# Altium schematic sheet USB2514 POWER DISTRIBUTION SWITCHES.SchDoc
size A4; DocumentNumber: 4; SheetNumber: 4; SheetTotal: 6
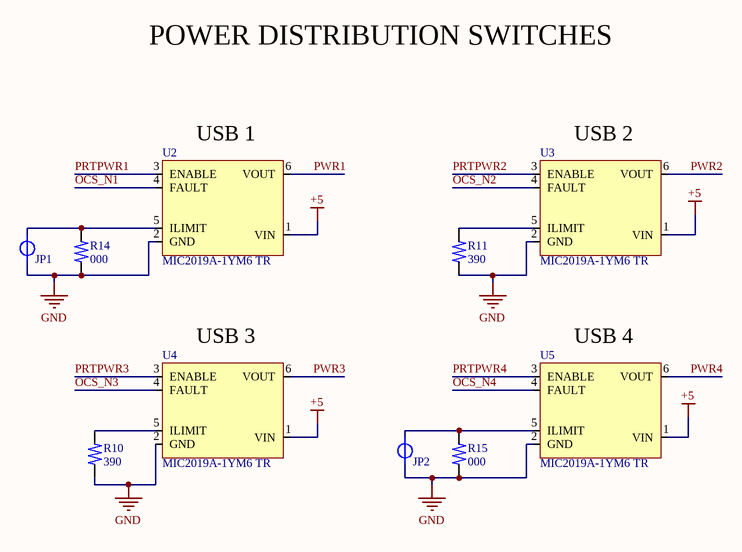
[diagram p0: USB2514 POWER DISTRIBUTION SWITCHES.SchDoc]

## Parts
JP1  JUMP_N-C  [JUMP_N-C 0,254]  (value not drawn)
JP2  JUMP_N-C  [JUMP_N-C 0,254]  (value not drawn)
R10  390  [RESC1608X06N-0603]
R11  390  [RESC1608X06N-0603]
R14  000  [RESC1608X06N-0603]
R15  000  [RESC1608X06N-0603]
U2  MIC2019A-1YM6 TR  [SOT95P280X90-6N]
U3  MIC2019A-1YM6 TR  [SOT95P280X90-6N]
U4  MIC2019A-1YM6 TR  [SOT95P280X90-6N]
U5  MIC2019A-1YM6 TR  [SOT95P280X90-6N]

## Nets
+5: U2.1(VIN) U3.1(VIN) U4.1(VIN) U5.1(VIN)
GND: JP1.1 JP2.1 R10.1 R11.1 R14.1 R15.1 U2.2(GND) U3.2(GND) U4.2(GND) U5.2(GND)
OCS_N1: U2.4(FAULT)
OCS_N2: U3.4(FAULT)
OCS_N3: U4.4(FAULT)
OCS_N4: U5.4(FAULT)
PRTPWR1: U2.3(ENABLE)
PRTPWR2: U3.3(ENABLE)
PRTPWR3: U4.3(ENABLE)
PRTPWR4: U5.3(ENABLE)
PWR1: U2.6(VOUT)
PWR2: U3.6(VOUT)
PWR3: U4.6(VOUT)
PWR4: U5.6(VOUT)
NetJP1_2: JP1.2 R14.2 U2.5(ILIMIT)
NetJP2_2: JP2.2 R15.2 U5.5(ILIMIT)
NetR10_2: R10.2 U4.5(ILIMIT)
NetR11_2: R11.2 U3.5(ILIMIT)

## Notes on the sheet
- POWER DISTRIBUTION SWITCHES
- (near U2) USB 1
- (near U3) USB 2
- (near U4) USB 3
- (near U5) USB 4

## Library data of the parts
R10 R11 R14 R15 = RES_0603_1K